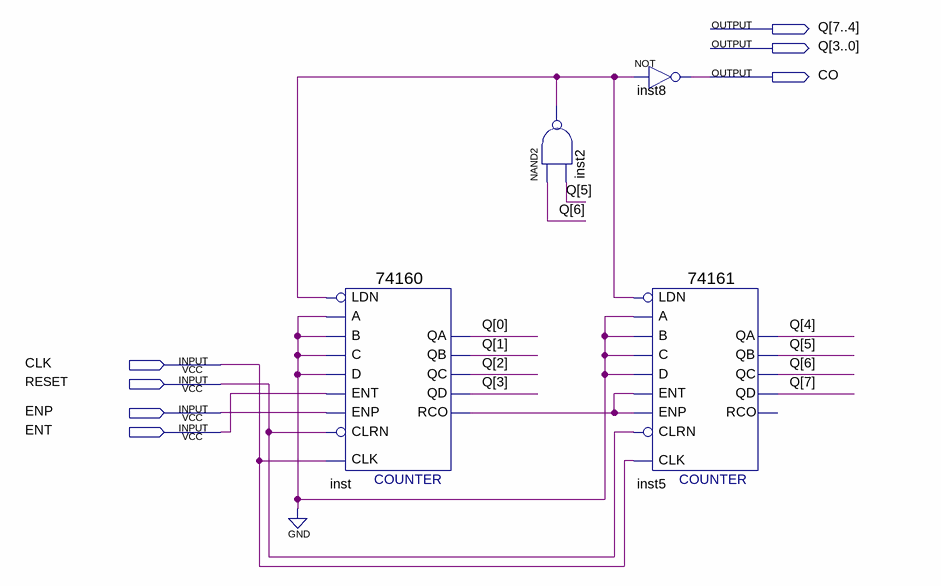
[diagram p0: schematic sheet]
// Quartus schematic counter2.bdf as structural Verilog: 4 symbols, 7 pins
module counter2 (
  input  CLK,
  input  RESET,
  input  ENP,
  input  ENT,
  output [7:0] Q,
  output CO
);

  wire inst2_out, inst_rco;

  \74160  inst (
    .CLK(CLK), .ENT(ENT), .A(1'b0), .B(1'b0), .C(1'b0), .D(1'b0), .LDN(inst2_out), .ENP(ENP), .CLRN(RESET),
    .QD(Q[3]), .QA(Q[0]), .QB(Q[1]), .QC(Q[2]), .RCO(inst_rco));
  nand inst2 (inst2_out, Q[6], Q[5]);
  not inst8 (CO, inst2_out);
  \74161  inst5 (
    .CLRN(RESET), .CLK(CLK), .ENP(inst_rco), .LDN(inst2_out), .A(1'b0), .D(1'b0), .ENT(inst_rco), .B(1'b0),
    .C(1'b0), .QD(Q[7]), .QC(Q[6]), .QB(Q[5]), .QA(Q[4]));  // open: RCO
endmodule
